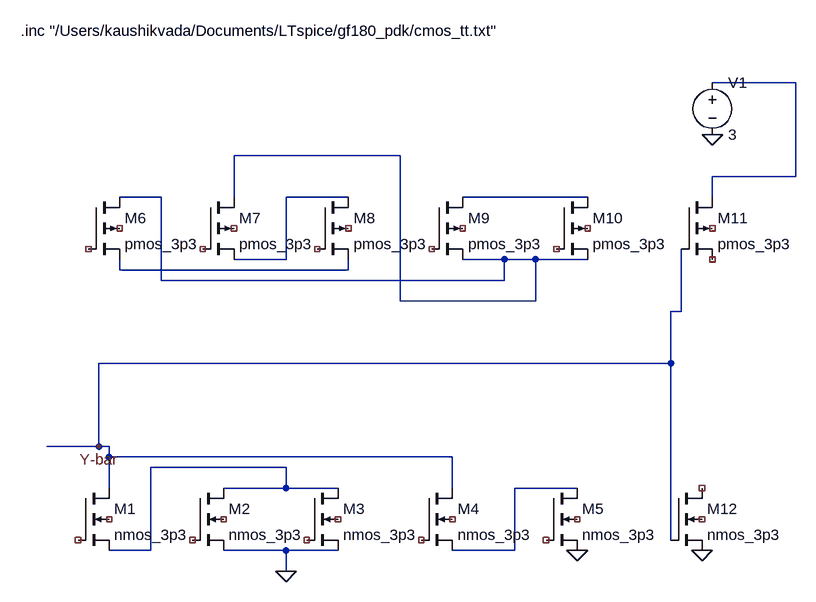
[diagram p0: schematic Q2_1.asc]
Q2_1.asc, the LTspice schematic file:
Version 4
SHEET 1 1028 880
WIRE 1024 112 896 112
WIRE 416 224 160 224
WIRE 1024 256 1024 112
WIRE 1024 256 896 256
WIRE 48 288 -16 288
WIRE 160 288 160 224
WIRE 336 288 240 288
WIRE 704 288 512 288
WIRE 896 288 896 256
WIRE 240 384 240 288
WIRE 240 384 160 384
WIRE 576 384 512 384
WIRE 624 384 576 384
WIRE 704 384 624 384
WIRE -16 400 -16 384
WIRE 336 400 336 384
WIRE 336 400 -16 400
WIRE 48 416 48 288
WIRE 576 416 576 384
WIRE 576 416 48 416
WIRE 416 448 416 224
WIRE 624 448 624 384
WIRE 624 448 416 448
WIRE 848 464 848 368
WIRE 848 464 832 464
WIRE 832 544 832 464
WIRE 832 544 -48 544
WIRE -48 672 -48 544
WIRE -48 672 -128 672
WIRE -32 672 -48 672
WIRE -32 688 -32 672
WIRE 496 688 -32 688
WIRE 240 704 32 704
WIRE -32 736 -32 688
WIRE 240 736 240 704
WIRE 240 736 144 736
WIRE 320 736 240 736
WIRE 496 736 496 688
WIRE 688 736 592 736
WIRE 832 816 832 544
WIRE 32 832 32 704
WIRE 32 832 -32 832
WIRE 240 832 144 832
WIRE 320 832 240 832
WIRE 592 832 592 736
WIRE 592 832 496 832
WIRE 240 864 240 832
FLAG -48 672 Y-bar
FLAG 240 864 0
FLAG 688 832 0
FLAG 880 832 0
FLAG 896 192 0
SYMBOL nmos4 -80 736 R0
SYMATTR InstName M1
SYMATTR Value nmos_3p3
SYMBOL nmos4 96 736 R0
SYMATTR InstName M2
SYMATTR Value nmos_3p3
SYMBOL nmos4 272 736 R0
SYMATTR InstName M3
SYMATTR Value nmos_3p3
SYMBOL nmos4 448 736 R0
SYMATTR InstName M4
SYMATTR Value nmos_3p3
SYMBOL nmos4 640 736 R0
SYMATTR InstName M5
SYMATTR Value nmos_3p3
SYMBOL pmos4 -64 288 R0
SYMATTR InstName M6
SYMATTR Value pmos_3p3
SYMBOL pmos4 112 288 R0
SYMATTR InstName M7
SYMATTR Value pmos_3p3
SYMBOL pmos4 288 288 R0
SYMATTR InstName M8
SYMATTR Value pmos_3p3
SYMBOL pmos4 464 288 R0
SYMATTR InstName M9
SYMATTR Value pmos_3p3
SYMBOL pmos4 656 288 R0
SYMATTR InstName M10
SYMATTR Value pmos_3p3
SYMBOL pmos4 848 288 R0
SYMATTR InstName M11
SYMATTR Value pmos_3p3
SYMBOL nmos4 832 736 R0
SYMATTR InstName M12
SYMATTR Value nmos_3p3
SYMBOL Voltage 896 96 R0
SYMATTR InstName V1
SYMATTR Value 3
TEXT -168 32 Left 2 !.inc "/Users/kaushikvada/Documents/LTspice/gf180_pdk/cmos_tt.txt"

The netlist it stands for:
* Q2_1.asc
M1 Y-bar NC_01 N006 NC_02 nmos_3p3
M2 N006 NC_03 0 NC_04 nmos_3p3
M3 N006 NC_05 0 NC_06 nmos_3p3
M4 Y-bar NC_07 N007 NC_08 nmos_3p3
M5 N007 NC_09 0 NC_10 nmos_3p3
M6 N002 NC_11 N005 NC_12 pmos_3p3
M7 N002 NC_13 N003 NC_14 pmos_3p3
M8 N003 NC_15 N005 NC_16 pmos_3p3
M9 N004 NC_17 N002 NC_18 pmos_3p3
M10 N004 NC_19 N002 NC_20 pmos_3p3
M11 N001 Y-bar NC_21 NC_22 pmos_3p3
M12 NC_23 Y-bar 0 NC_24 nmos_3p3
V1 N001 0 3
.model NMOS NMOS
.model PMOS PMOS
.lib standard.mos
.inc "/Users/kaushikvada/Documents/LTspice/gf180_pdk/cmos_tt.txt"
.backanno
.end